# EAGLE design challenge6 (EAGLE 9.2.2)
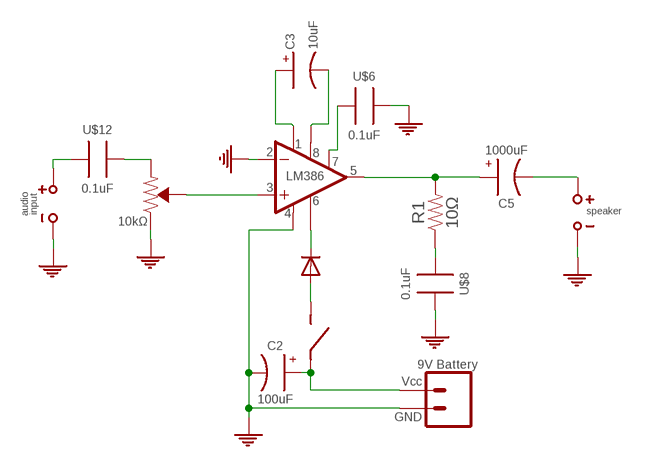
[diagram p0: schematic, sheet 1]

## Parts
IC1  LM386  [LM386_DIP08]
U$1  DIODE  [DIODE_1N4001]
U$2  SWITCH  [SWITCH]
U$3  C2_100UF  [CAP_100UF_POLARIZED]
U$4  9V_BATTERY  [9V_BATT]
U$5  C3_10UF  [CAP_10UF_POLARIZED]
U$6  C_0.1UF  [CAP_0.1UF]
U$7  R1_10Ω  [R1_10Ω]
U$8  C_0.1UF  [CAP_0.1UF]
U$9  C5_1000UF  [CAP_1000UF_POLARIZED]
U$10  SPEAKER  [SPEAKER]
U$11  POTENTIOMETER_10KΩ  [POT_10KΩ]
U$12  C_0.1UF  [CAP_0.1UF]
U$13  AUDIO_INPUT  [AUDIO_INPUT]

## Nets
GND: IC1.2(-IN_2) IC1.4(V-_4) U$3.-(K) U$4.- U$6.P$2 U$8.P$2 U$10.- U$11.3(CW_MINVOL) U$13.-
N$1: IC1.6(V+_6) U$1.C
N$2: U$1.A U$2.2
N$3: U$2.1 U$3.+(A) U$4.+
N$4: IC1.8(GAIN2_8) U$5.-(K)
N$5: IC1.1(GAIN1_1) U$5.+(A)
N$6: IC1.7(BYPASS_7) U$6.P$1
N$7: U$9.-(K) U$10.+
N$8: IC1.5(OUT_5) U$7.2 U$9.+(A)
N$9: U$7.1 U$8.P$1
N$10: U$12.P$1 U$13.+
N$11: U$11.1(CCW_MAXVOL) U$12.P$2
N$12: IC1.3(+IN_3) U$11.2(WIPER)

## Library data of the parts
IC1 = ECE5_Speaker_V2(1):LM386: LM386 LM386: http://smallbear-electronics.mybigcommerce.com/ic-lm386-n3/; AVAILABILITY: Unavailable; MF: National Semiconductor; MP: LM386; PACKAGE: SOIC-8 National Semiconductor; PRICE: None
U$1 = ECE5_Speaker_V2(1):DIODE
U$2 = ECE5_Speaker_V2(1):SWITCH
U$3 = ECE5_Speaker_V2(1):C2_100UF
U$4 = ECE5_Speaker_V2(1):9V_BATTERY
U$5 = ECE5_Speaker_V2(1):C3_10UF
U$6 U$8 U$12 = ECE5_Speaker_V2(1):C_0.1UF
U$7 = ECE5_Speaker_V2(1):R1_10Ω
U$9 = ECE5_Speaker_V2(1):C5_1000UF
U$10 = ECE5_Speaker_V2(1):SPEAKER
U$11 = ECE5_Speaker_V2(1):POTENTIOMETER_10KΩ
U$13 = ECE5_Speaker_V2(1):AUDIO_INPUT

## Net classes
0 default: clearance 0.205 mm

## Board
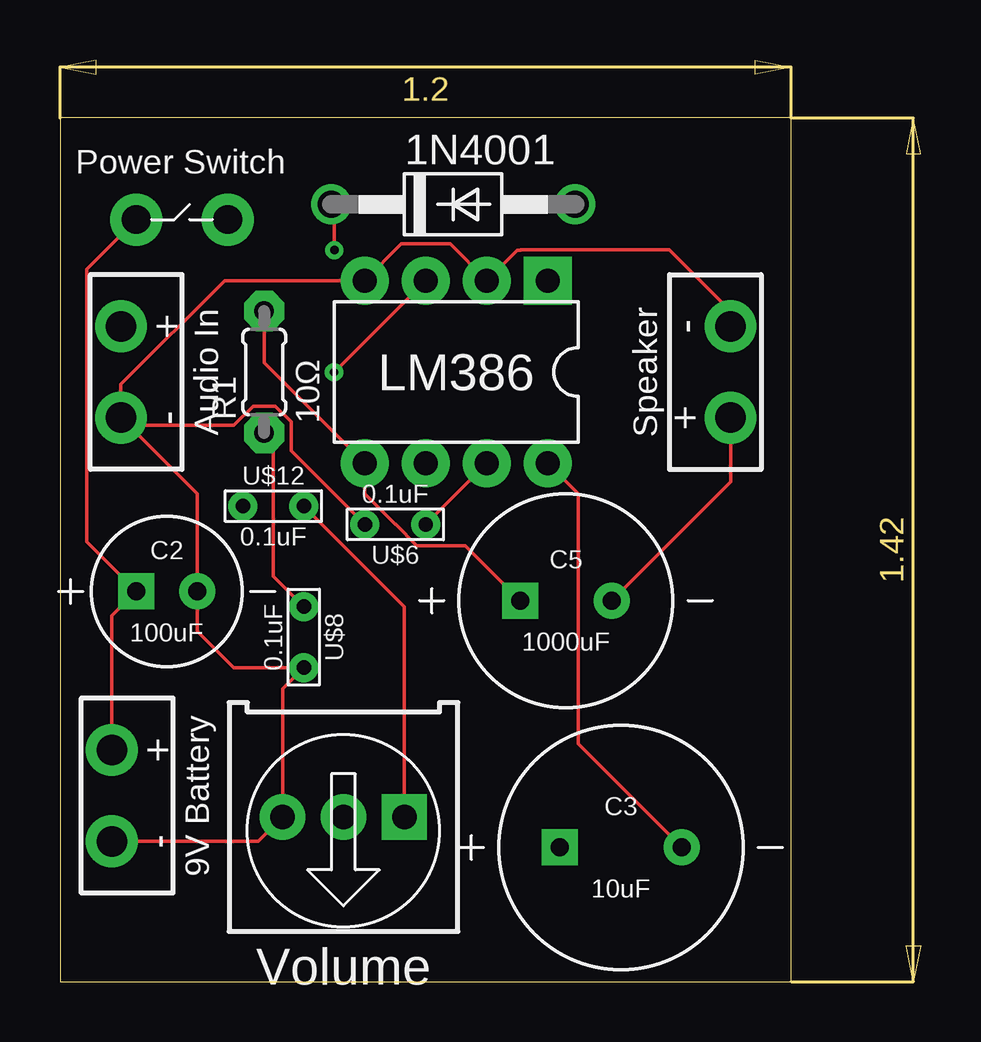
[diagram p1: board, top side]
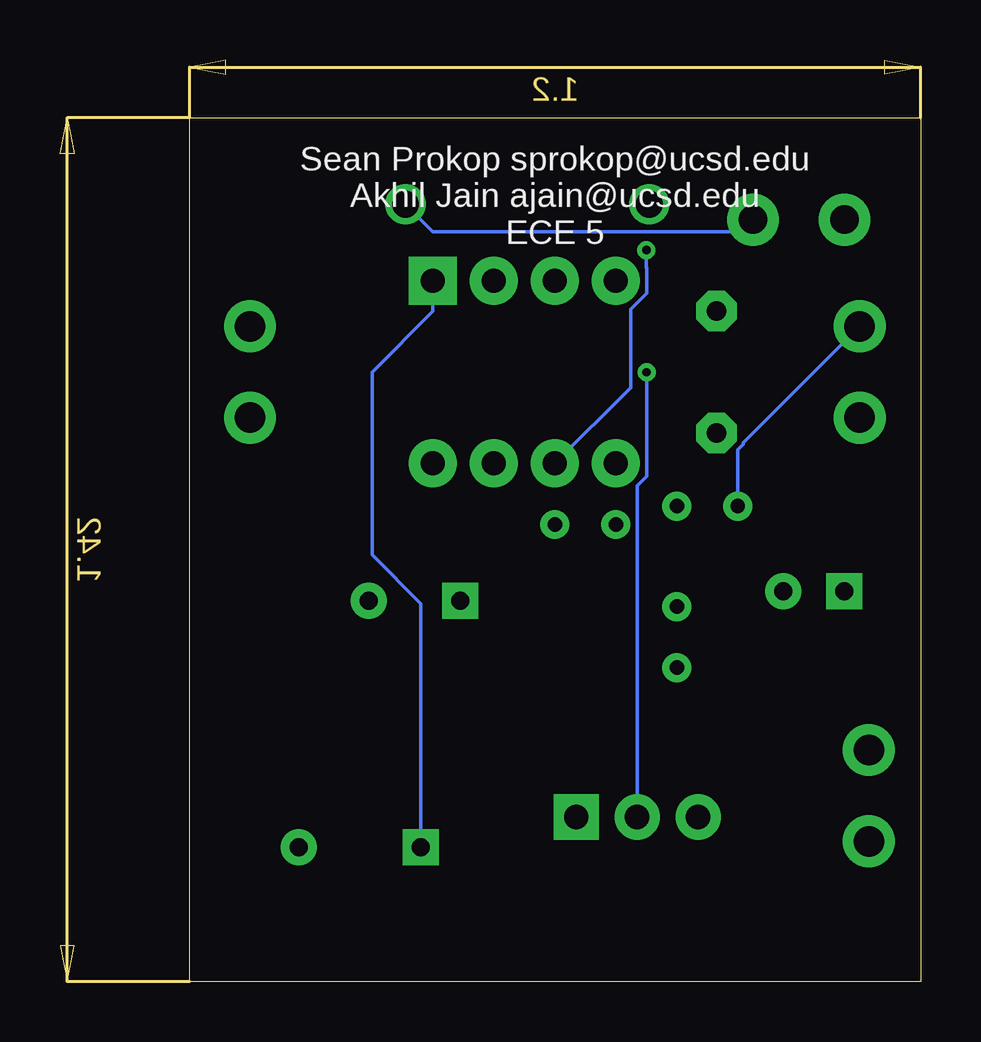
[diagram p2: board, bottom side, seen from below]

Size 30.46 x 35.99 mm. Coordinates in mm from the lower left corner, seen from the top.
Outline: 0,0 30.46,0 30.46,35.99 0,35.99 0,0
Copper layers (1*16): Top 0.035mm / dielectric 1.5mm / Bottom 0.035mm
Design rules "default": minimum track width 6mil, minimum drill 0.35mm, track to track 6mil, track to pad 6mil, pad to pad 6mil, via to via 6mil, smd to smd 6mil, copper to edge 40mil, drill to drill 6mil, minimum pad ring 10mil, minimum via ring 8mil, stop-mask expansion 4mil, vias tented up to drill 0mil, thermal gap 10mil

### Footprints (pad centres in the part's own frame; a part is rotated, then mirrored left to right if it is on the bottom)
LM386_DIP08 = drill 1 pad 2 square: 1 -3.81,-3.81 | drill 1 pad 2: 2 -1.27,-3.81; 3 1.27,-3.81; 4 3.81,-3.81; 5 3.81,3.81; 6 1.27,3.81; 7 -1.27,3.81; 8 -3.81,3.81
DIODE_1N4001 = drill 1.118: A 5.08,0; C -5.08,0
SWITCH = drill 1.2 pad 2.159: 1 -1.905,0; 2 1.905,0
CAP_100UF_POLARIZED = drill 0.75 pad 1.5 square: + -1.27,0 | drill 0.75 pad 1.5: - 1.27,0
9V_BATT = drill 1.27 pad 2.159: + -1.905,0; - 1.905,0
CAP_10UF_POLARIZED = drill 0.75 pad 1.5 square: + -2.54,0 | drill 0.75 pad 1.5: - 2.54,0
CAP_0.1UF = drill 0.6 pad 1.2: P$1 -1.27,0; P$2 1.27,0
R1_10Ω = drill 0.813 pad 1.676 octagon: 1 -2.54,0; 2 2.54,0
CAP_1000UF_POLARIZED = drill 0.75 pad 1.5 square: + -1.905,0 | drill 0.75 pad 1.5: - 1.905,0
SPEAKER = drill 1.27 pad 2.159: + -1.905,0; - 1.905,0
POT_10KΩ = drill 1.016 pad 1.88 square: 1 -2.54,0 | drill 1.016 pad 1.88: 2 0,0; 3 2.54,0
AUDIO_INPUT = drill 1.27 pad 2.159: + -1.905,0; - 1.905,0

### Placement (x,y rotation side)
IC1  16.51,25.4 180 top
U$1  16.38,32.38 0 top
U$2  5.08,31.75 0 top
U$3  4.45,16.26 0 top
U$4  2.16,7.75 270 top
U$5  23.37,5.59 0 top
U$6  13.97,19.05 180 top
U$7  8.51,25.4 90 top
U$8  10.16,14.35 270 top
U$9  21.08,15.88 0 top
U$10  27.94,25.4 90 top
U$11  11.81,6.86 180 top
U$12  8.89,19.81 0 top
U$13  2.54,25.4 270 top

### Tracks (layer width: path | path; a pad name or v marks a point on that pad's centre or on a via)
GND
  Top 0.152: 2.86,23.18 5.71,20.32 U$3.- 5.71,14.61 7.24,13.08 U$8.P$2 9.27,12.19 U$11.3 8.26,5.84 U$4.- | 2.86,23.18 U$13.- 2.54,24.89 6.86,29.21 IC1.4 14.22,30.73 16.26,30.73 IC1.2 19.05,30.48 19.19,30.48 19.2,30.49 25.39,30.49 27.94,27.94 U$10.- | U$6.P$2 9.63,22.12 9.63,23.32 8.97,23.98 8.04,23.98 7.24,23.18 2.86,23.18
N$1  (via drill 0.35)
  Top 0.152: v11.43,30.48 11.43,32.26 U$1.C
  Bottom 0.152: v11.43,30.48 11.43,29.75 11.42,29.74 11.42,28.68 12.08,28.02 12.08,24.75 IC1.6
N$2
  Bottom 0.152: U$1.A 20.32,31.24 7.49,31.24 U$2.2
N$3
  Top 0.152: U$2.1 1.1,29.68 1.1,18.33 U$3.+ 2.16,15.24 U$4.+
N$4
  Top 0.152: U$5.- 21.59,9.91 21.59,20.32 IC1.8
N$5
  Bottom 0.152: U$5.+ 20.83,15.75 22.86,17.78 22.86,25.4 20.32,27.94 IC1.1
N$6
  Top 0.152: IC1.7 U$6.P$1
N$7
  Top 0.152: U$9.- 27.94,20.83 U$10.+
N$8
  Top 0.152: U$9.+ 16.88,18.17 14.88,18.17 13.99,19.05 13.97,19.05 12.7,20.32 IC1.5 8.51,25.78 U$7.2
N$9
  Top 0.152: U$7.1 8.89,22.48 8.89,16.89 U$8.P$1
N$10
  Bottom 0.152: U$13.+ 7.39,22.45 7.39,22.4 7.62,22.17 U$12.P$1
N$11
  Top 0.152: U$11.1 14.35,15.62 U$12.P$2
N$12  (via drill 0.35)
  Top 0.152: v11.42,25.39 IC1.3
  Bottom 0.152: U$11.2 11.81,20.67 11.42,21.06 v11.42,25.39

### Text on the board
bPlace: Sean Prokop sprokop@ucsd.edu / Akhil Jain ajain@ucsd.edu / ECE 5